# EAGLE schematic ArmBoardNew-New_Main_Board (EAGLE 8.6.0)
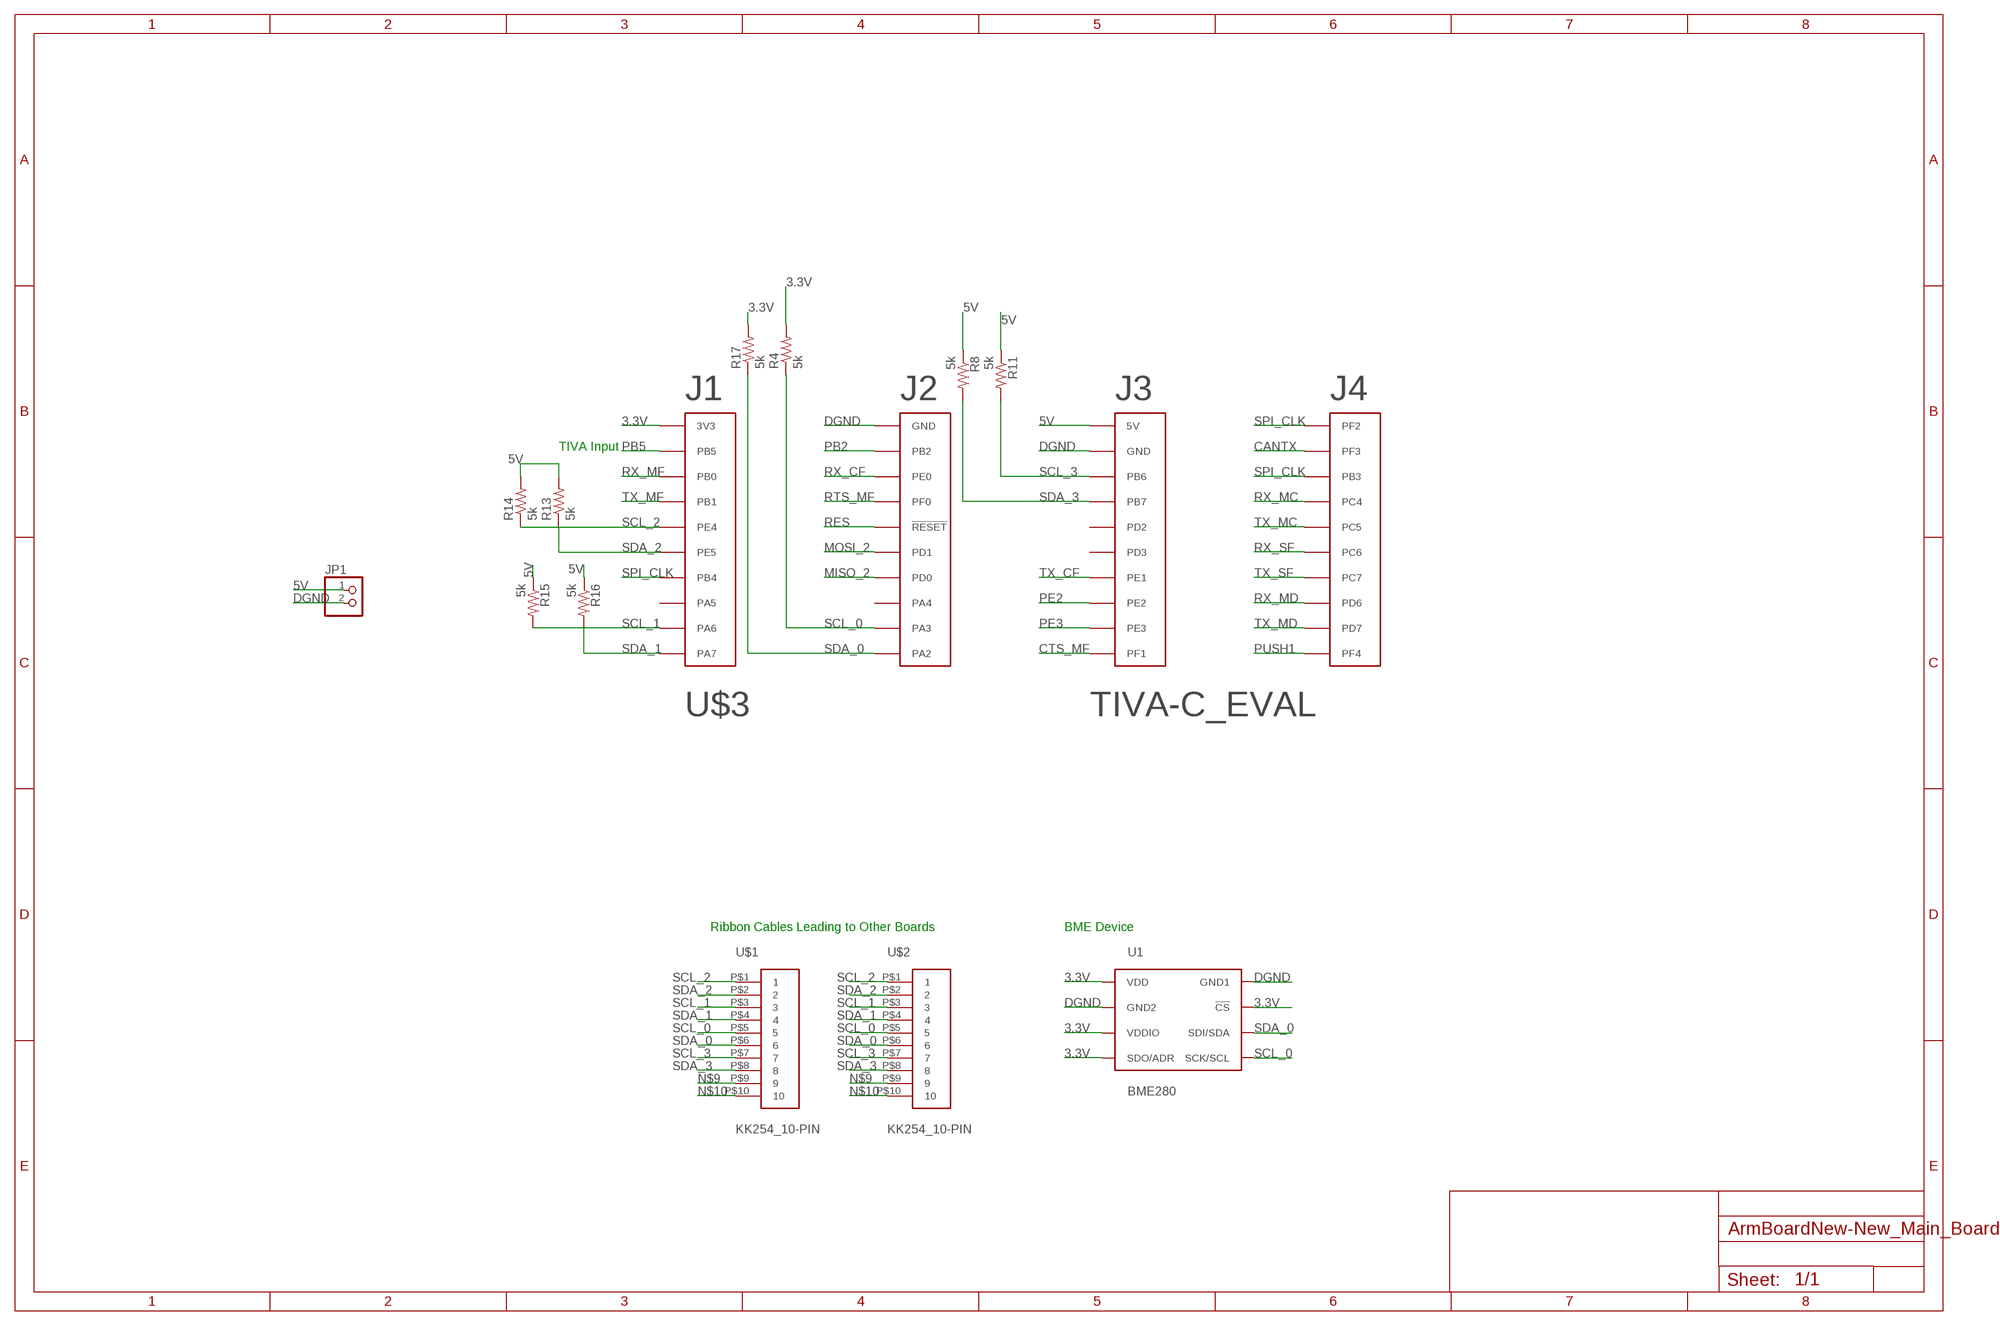
[diagram p0: schematic, sheet 1]

## Parts
JP1  PINHD-1X2  [1X02]
R4  5k  R-US_R0805  [R0805]
R8  5k  R-US_R0805  [R0805]
R11  5k  R-US_R0805  [R0805]
R13  5k  R-US_R0805  [R0805]
R14  5k  R-US_R0805  [R0805]
R15  5k  R-US_R0805  [R0805]
R16  5k  R-US_R0805  [R0805]
R17  5k  R-US_R0805  [R0805]
U1  BME280  [BME280_LGA]
U$1  KK254_10-PIN  [KK254_10-PIN]
U$2  KK254_10-PIN  [KK254_10-PIN]
U$3  TIVA-C_EVAL  [TIVA-C_EVAL]

## Nets
3.3V: R4.2 R17.2 U1.P$2(!CS) U1.P$5(SDO/ADR) U1.P$6(VDDIO) U1.P$8(VDD) U$3.1-1(3V3)
5V: JP1.1 R8.1 R11.1 R13.2 R14.2 R15.1 R16.1 U$3.3-1(5V)
CANTX: U$3.4-2(PF3)
CTS_MF: U$3.3-10(PF1)
DGND: JP1.2 U1.P$1(GND1) U1.P$7(GND2) U$3.2-1(GND) U$3.3-2(GND)
MISO_2: U$3.2-7(PD0)
MOSI_2: U$3.2-6(PD1)
N$9: U$1.P$9 U$2.P$9
N$10: U$1.P$10 U$2.P$10
PB2: U$3.2-2(PB2)
PB5: U$3.1-2(PB5)
PE2: U$3.3-8(PE2)
PE3: U$3.3-9(PE3)
PUSH1: U$3.4-10(PF4)
RES: U$3.2-5(!RESET!)
RTS_MF: U$3.2-4(PF0)
RX_CF: U$3.2-3(PE0)
RX_MC: U$3.4-4(PC4)
RX_MD: U$3.4-8(PD6)
RX_MF: U$3.1-3(PB0)
RX_SF: U$3.4-6(PC6)
SCL_0: R4.1 U1.P$4(SCK/SCL) U$1.P$5 U$2.P$5 U$3.2-9(PA3)
SCL_1: R15.2 U$1.P$3 U$2.P$3 U$3.1-9(PA6)
SCL_2: R14.1 U$1.P$1 U$2.P$1 U$3.1-5(PE4)
SCL_3: R11.2 U$1.P$7 U$2.P$7 U$3.3-3(PB6)
SDA_0: R17.1 U1.P$3(SDI/SDA) U$1.P$6 U$2.P$6 U$3.2-10(PA2)
SDA_1: R16.2 U$1.P$4 U$2.P$4 U$3.1-10(PA7)
SDA_2: R13.1 U$1.P$2 U$2.P$2 U$3.1-6(PE5)
SDA_3: R8.2 U$1.P$8 U$2.P$8 U$3.3-4(PB7)
SPI_CLK: U$3.1-7(PB4) U$3.4-1(PF2) U$3.4-3(PB3)
TX_CF: U$3.3-7(PE1)
TX_MC: U$3.4-5(PC5)
TX_MD: U$3.4-9(PD7)
TX_MF: U$3.1-4(PB1)
TX_SF: U$3.4-7(PC7)
Unconnected: U$3.1-8(PA5) U$3.2-8(PA4) U$3.3-5(PD2) U$3.3-6(PD3)

## Notes on the sheet
- TIVA Input
- Ribbon Cables Leading to Other Boards | BME Device

## Library data of the parts
JP1 = pinhead:PINHD-1X2: PIN HEADER
R4 R8 R11 R13-R17 = resistor:R-US_: RESISTOR, American symbol
U1 = BME280ComponentLibrary:BME280; PROD_ID: IC-13090
U$1 U$2 = molex:KK254_10-PIN: KK254 10-pin Datasheet <http://www.molex.com/molex/products/datasheet.jsp?part=active/0022102101_PCB_HEADERS.xml>
U$3 = texas:TIVA-C_EVAL: Texas Instruments Tiva-C TM4C123G LaunchPad Evaluation Board Part number EK-TM4C123GXL Datasheet <http://www.ti.com/lit/ug/spmu296/spmu296.pdf> Microcontroller <http://www.ti.com/lit/ds/spms376e/spms376e.pdf>